# EAGLE schematic S2U_Daughter (EAGLE 7.6.0)
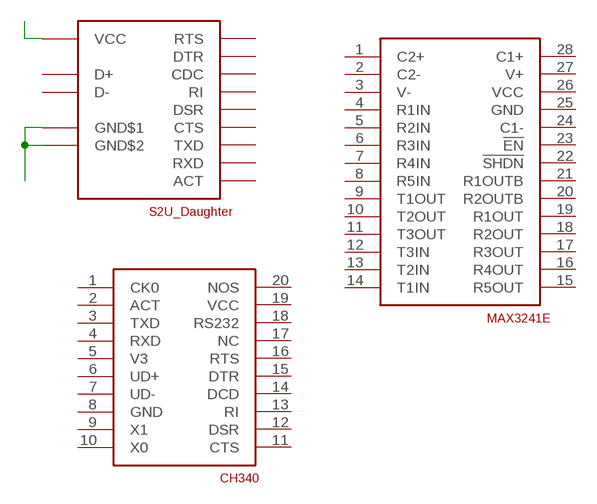
[diagram p0: schematic, sheet 1]

## Parts
U$1  S2U_DAUGHTER  [S2U_DAUGHTER_HEADERS]
U$2  CH340  [SSOP20]
U$3  MAX3241E  [TSSOP28]

## Nets
N$1: U$1.GND$1(GND$2) U$1.GND(GND$1)
N$2: U$1.VCC
Unconnected: U$1.ACT U$1.CDC U$1.CTS U$1.D+ U$1.D- U$1.DSR U$1.DTR U$1.RI U$1.RTS U$1.RXD U$1.TXD U$2.1(CK0) U$2.2(ACT) U$2.3(TXD) U$2.4(RXD) U$2.5(V3) U$2.6(UD+) U$2.7(UD-) U$2.8(GND) U$2.9(X1) U$2.10(X0) U$2.11(CTS) U$2.12(DSR) U$2.13(RI) U$2.14(DCD) U$2.15(DTR) U$2.16(RTS) U$2.17(NC) U$2.18(RS232) U$2.19(VCC) U$2.20(NOS) U$3.1(C2+) U$3.2(C2-) U$3.3(V-) U$3.4(R1IN) U$3.5(R2IN) U$3.6(R3IN) U$3.7(R4IN) U$3.8(R5IN) U$3.9(T1OUT) U$3.10(T2OUT) U$3.11(T3OUT) U$3.12(T3IN) U$3.13(T2IN) U$3.14(T1IN) U$3.15(R5OUT) U$3.16(R4OUT) U$3.17(R3OUT) U$3.18(R2OUT) U$3.19(R1OUT) U$3.20(R2OUTB) U$3.21(R1OUTB) U$3.22(!SHDN) U$3.23(!EN) U$3.24(C1-) U$3.25(GND) U$3.26(VCC) U$3.27(V+) U$3.28(C1+)

## Library data of the parts
U$1 = S2U_lib:S2U_DAUGHTER
U$2 = S2U_lib:CH340
U$3 = S2U_lib:MAX3241E